# EAGLE design Atmel_ICE3_Adapter_6Pin (EAGLE 6.6.0)
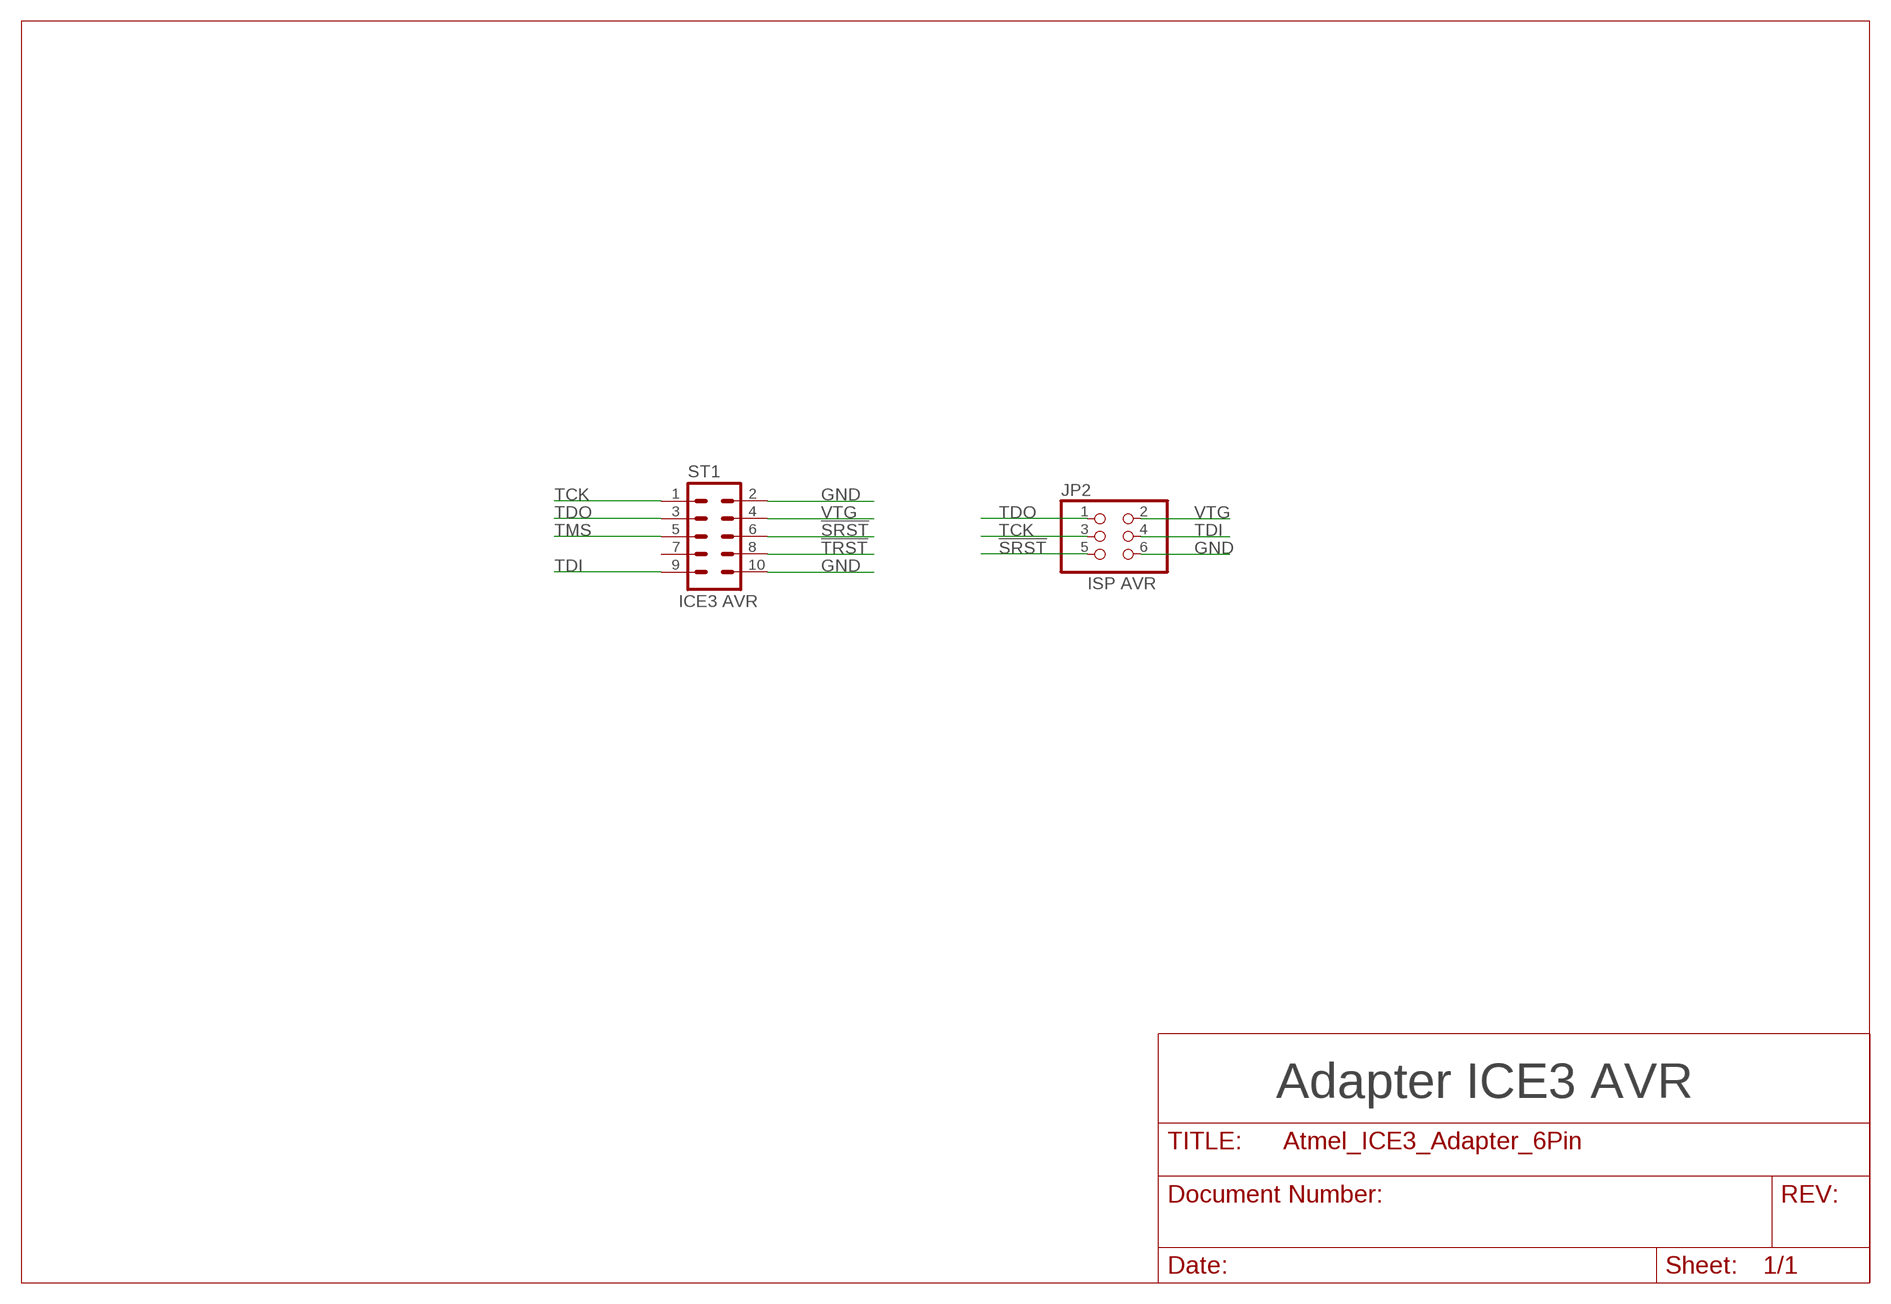
[diagram p0: schematic, sheet 1]

## Parts
JP2  PINHD-2X3_2.54  [2X03]
ST1  MA05-2_WANNE  [MA05-2_WANNE]

## Nets
!SRST: JP2.5 ST1.6
!TRST: ST1.8
GND: JP2.6 ST1.2 ST1.10
TCK: JP2.3 ST1.1
TDI: JP2.4 ST1.9
TDO: JP2.1 ST1.3
TMS: ST1.5
VTG: JP2.2 ST1.4
Unconnected: ST1.7

## Notes on the sheet
- ISP AVR
- ICE3 AVR
- Adapter ICE3 AVR

## Library data of the parts
JP2 = pinhead_2:PINHD-2X3: PIN HEADER
ST1 = pin-header-1.27:MA05-2_WANNE

## Board
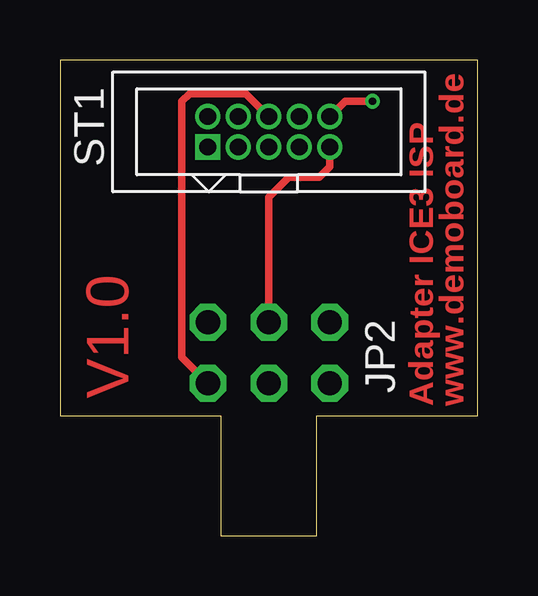
[diagram p1: board, top side]
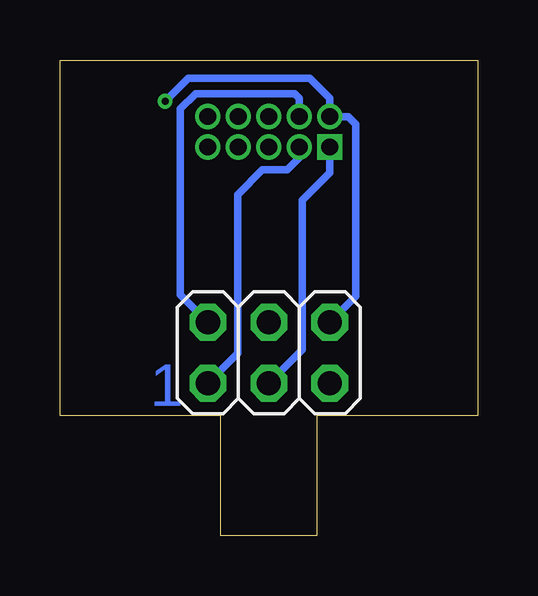
[diagram p2: board, bottom side, seen from below]

Size 17.4 x 19.82 mm. Coordinates in mm from the lower left corner, seen from the top.
Outline: 6.7,0 10.7,0 10.7,5 17.4,5 17.4,19.82 0,19.82 0,5 6.7,5 6.7,0
Copper layers (1*16): Top 0.035mm / dielectric 1.6mm / Bottom 0.035mm
Design rules "Elecrow_2-layer_PCB_eagle_rule": minimum track width 6mil, minimum drill 12mil, track to track 6mil, track to pad 6mil, pad to pad 6mil, via to via 8mil, smd to smd 0mil, copper to edge 20mil, drill to drill 10mil, minimum pad ring 6mil, minimum via ring 6mil, stop-mask expansion 0mil, vias tented up to drill 100mil, thermal gap 10mil

### Footprints (pad centres in the part's own frame; a part is rotated, then mirrored left to right if it is on the bottom)
2X03 = drill 1.016 octagon: 1 -2.54,-1.27; 2 -2.54,1.27; 3 0,-1.27; 4 0,1.27; 5 2.54,-1.27; 6 2.54,1.27
MA05-2_WANNE = drill 0.7 pad 1.016 square: 1 -2.54,-0.635 | drill 0.7 pad 1.016: 2 -2.54,0.635; 3 -1.27,-0.635; 4 -1.27,0.635; 5 0,-0.635; 6 0,0.635; 7 1.27,-0.635; 8 1.27,0.635; 9 2.54,-0.635; 10 2.54,0.635

### Placement (x,y rotation side)
JP2  8.7,7.62 0 bottom
ST1  8.7,16.83 0 top

### Tracks (layer width: path | path; a pad name or v marks a point on that pad's centre or on a via)
!SRST
  Top 0.305: ST1.6 7.75,18.41 5.4,18.41 5.08,18.1 5.08,7.43 JP2.5
GND  (via drill 0.3)
  Top 0.305: v13.02,18.1 11.88,18.1 ST1.10
  Bottom 0.305: JP2.6 5.08,9.97 5.08,17.14 5.4,17.46 ST1.2 6.16,18.23 6.99,19.05 12.06,19.05 v13.02,18.1
TCK
  Bottom 0.305: ST1.1 6.16,15.11 7.3,13.97 7.3,7.75 JP2.3
TDI
  Top 0.305: ST1.9 11.24,15.37 10.79,14.92 9.53,14.92 8.7,14.1 JP2.4
TDO
  Bottom 0.305: ST1.3 7.43,15.75 7.94,15.24 8.97,15.24 10,14.21 10,7.59 JP2.1
VTG
  Bottom 0.305: ST1.4 7.43,18.23 7.62,18.41 11.75,18.41 12.38,17.78 12.38,10.03 JP2.2

### Text on the board
Top: V1.0 | Adapter ICE3 ISP | www.demoboard.de
Bottom: 1